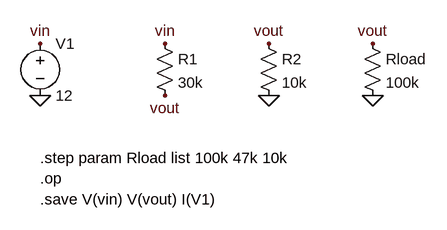
[diagram p0: schematic divisor_resistivo.asc]
divisor_resistivo.asc, the LTspice schematic file:
Version 4
SHEET 1 880 680
SYMBOL voltage 48 80 R0
SYMATTR InstName V1
SYMATTR Value 12
SYMBOL res 224 80 R0
SYMATTR InstName R1
SYMATTR Value 30k
SYMBOL res 384 80 R0
SYMATTR InstName R2
SYMATTR Value 10k
SYMBOL res 544 80 R0
SYMATTR InstName Rload
SYMATTR Value 100k
FLAG 48 96 vin
FLAG 48 176 0
FLAG 240 96 vin
FLAG 240 176 vout
FLAG 400 96 vout
FLAG 400 176 0
FLAG 560 96 vout
FLAG 560 176 0
TEXT 48 272 Left 2 !.step param Rload list 100k 47k 10k
TEXT 48 304 Left 2 !.op
TEXT 48 336 Left 2 !.save V(vin) V(vout) I(V1)

The netlist it stands for:
* divisor_resistivo.asc
V1 vin 0 12
R1 vin vout 30k
R2 vout 0 10k
Rload vout 0 100k
.step param Rload list 100k 47k 10k
.op
.save V(vin) V(vout) I(V1)
.backanno
.end